# EAGLE design Proto-BoosterPack-RevA1 (EAGLE 6.3)
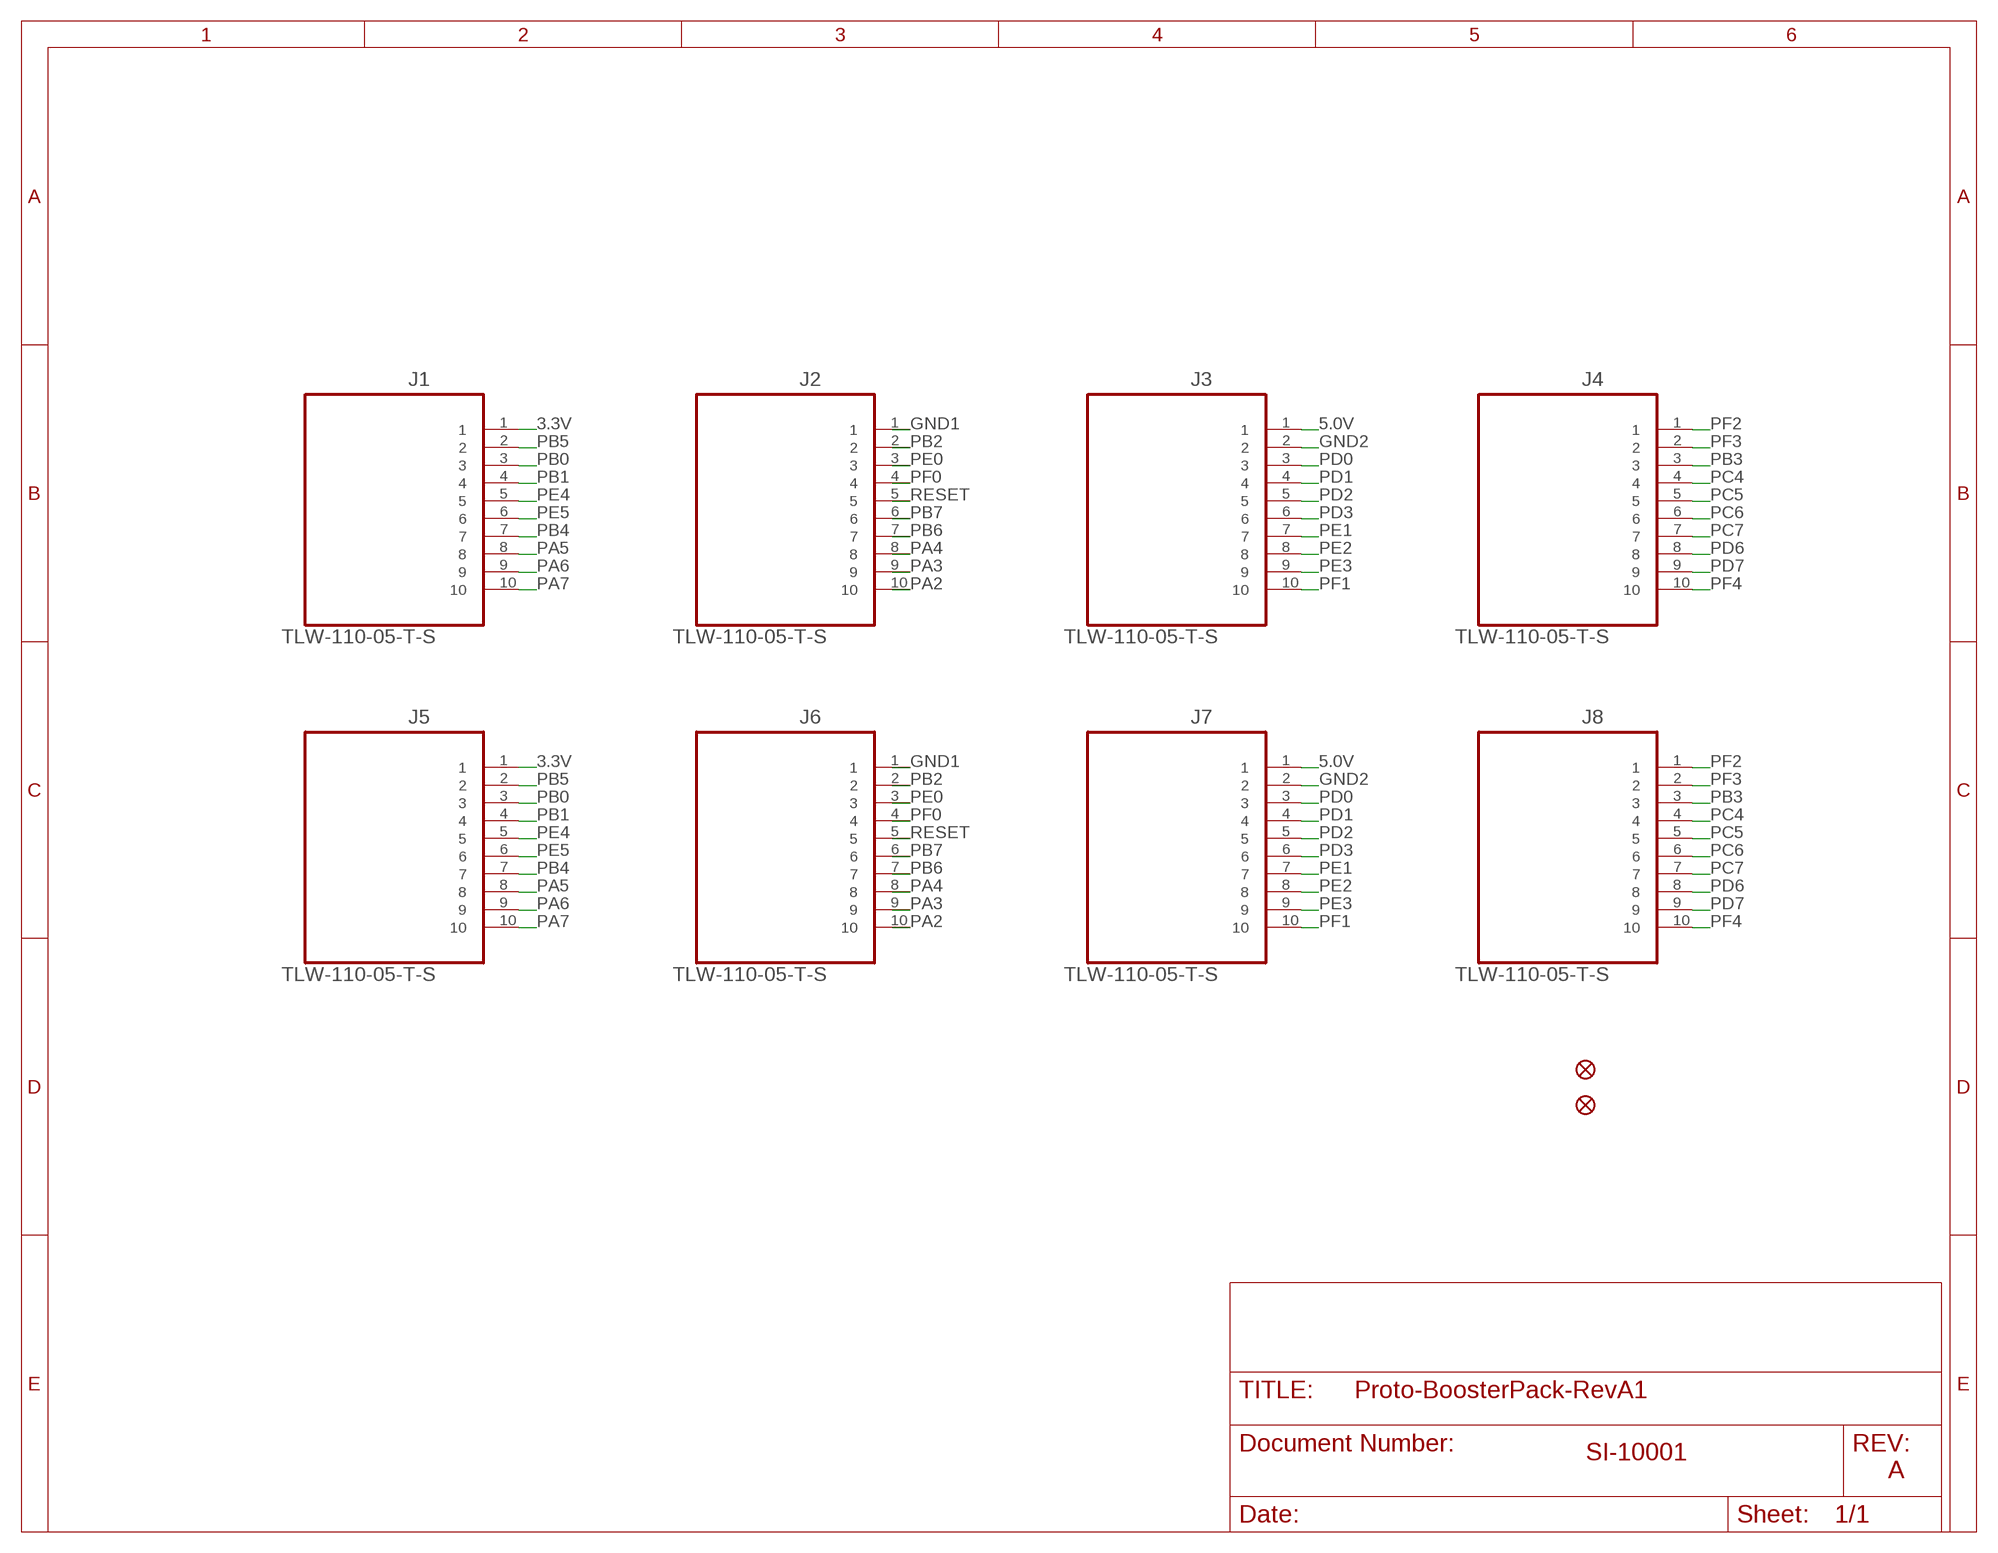
[diagram p0: schematic, sheet 1]

## Parts
FID1  FIDUCIAL1X2  [FIDUCIAL-1X2]
FID2  FIDUCIAL1X2  [FIDUCIAL-1X2]
J1  TLW-110-05-T-S  [SAMTEC_TLW-110-05-T-S]
J2  TLW-110-05-T-S  [SAMTEC_TLW-110-05-T-S]
J3  TLW-110-05-T-S  [SAMTEC_TLW-110-05-T-S]
J4  TLW-110-05-T-S  [SAMTEC_TLW-110-05-T-S]
J5  TLW-110-05-T-S  [SAMTEC_TLW-110-05-T-S]
J6  TLW-110-05-T-S  [SAMTEC_TLW-110-05-T-S]
J7  TLW-110-05-T-S  [SAMTEC_TLW-110-05-T-S]
J8  TLW-110-05-T-S  [SAMTEC_TLW-110-05-T-S]

## Nets
3.3V [power]: J1.1 J5.1
5.0V [power]: J3.1 J7.1
GND1 [power]: J2.1 J6.1
GND2 [power]: J3.2 J7.2
PA2: J2.10 J6.10
PA3: J2.9 J6.9
PA4: J2.8 J6.8
PA5: J1.8 J5.8
PA6: J1.9 J5.9
PA7: J1.10 J5.10
PB0: J1.3 J5.3
PB1: J1.4 J5.4
PB2: J2.2 J6.2
PB3: J4.3 J8.3
PB4: J1.7 J5.7
PB5: J1.2 J5.2
PB6: J2.7 J6.7
PB7: J2.6 J6.6
PC4: J4.4 J8.4
PC5: J4.5 J8.5
PC6: J4.6 J8.6
PC7: J4.7 J8.7
PD0: J3.3 J7.3
PD1: J3.4 J7.4
PD2: J3.5 J7.5
PD3: J3.6 J7.6
PD6: J4.8 J8.8
PD7: J4.9 J8.9
PE0: J2.3 J6.3
PE1: J3.7 J7.7
PE2: J3.8 J7.8
PE3: J3.9 J7.9
PE4: J1.5 J5.5
PE5: J1.6 J5.6
PF0: J2.4 J6.4
PF1: J3.10 J7.10
PF2: J4.1 J8.1
PF3: J4.2 J8.2
PF4: J4.10 J8.10
RESET: J2.5 J6.5

## Notes on the sheet
- SI-10001
- A

## Library data of the parts
FID1 FID2 = SparkFun-Aesthetics:FIDUCIAL: Fiducial Alignment Points Various fiducial points for machine vision alignment.
J1-J8 = SAMTEC-Txx_By_element14_Batch_1:TLW-110-05-T-S: CONNECTOR HEADER, 10 WAY, 1ROW; MPN: TLW-110-05-T-S; OC_FARNELL: -; OC_NEWARK: 12P0439; PACKAGE: CONN HEADER 10 POS .100 inch; SUPPLIER: SAMTEC

## Net classes
1 power: width 0.305 mm

## Board
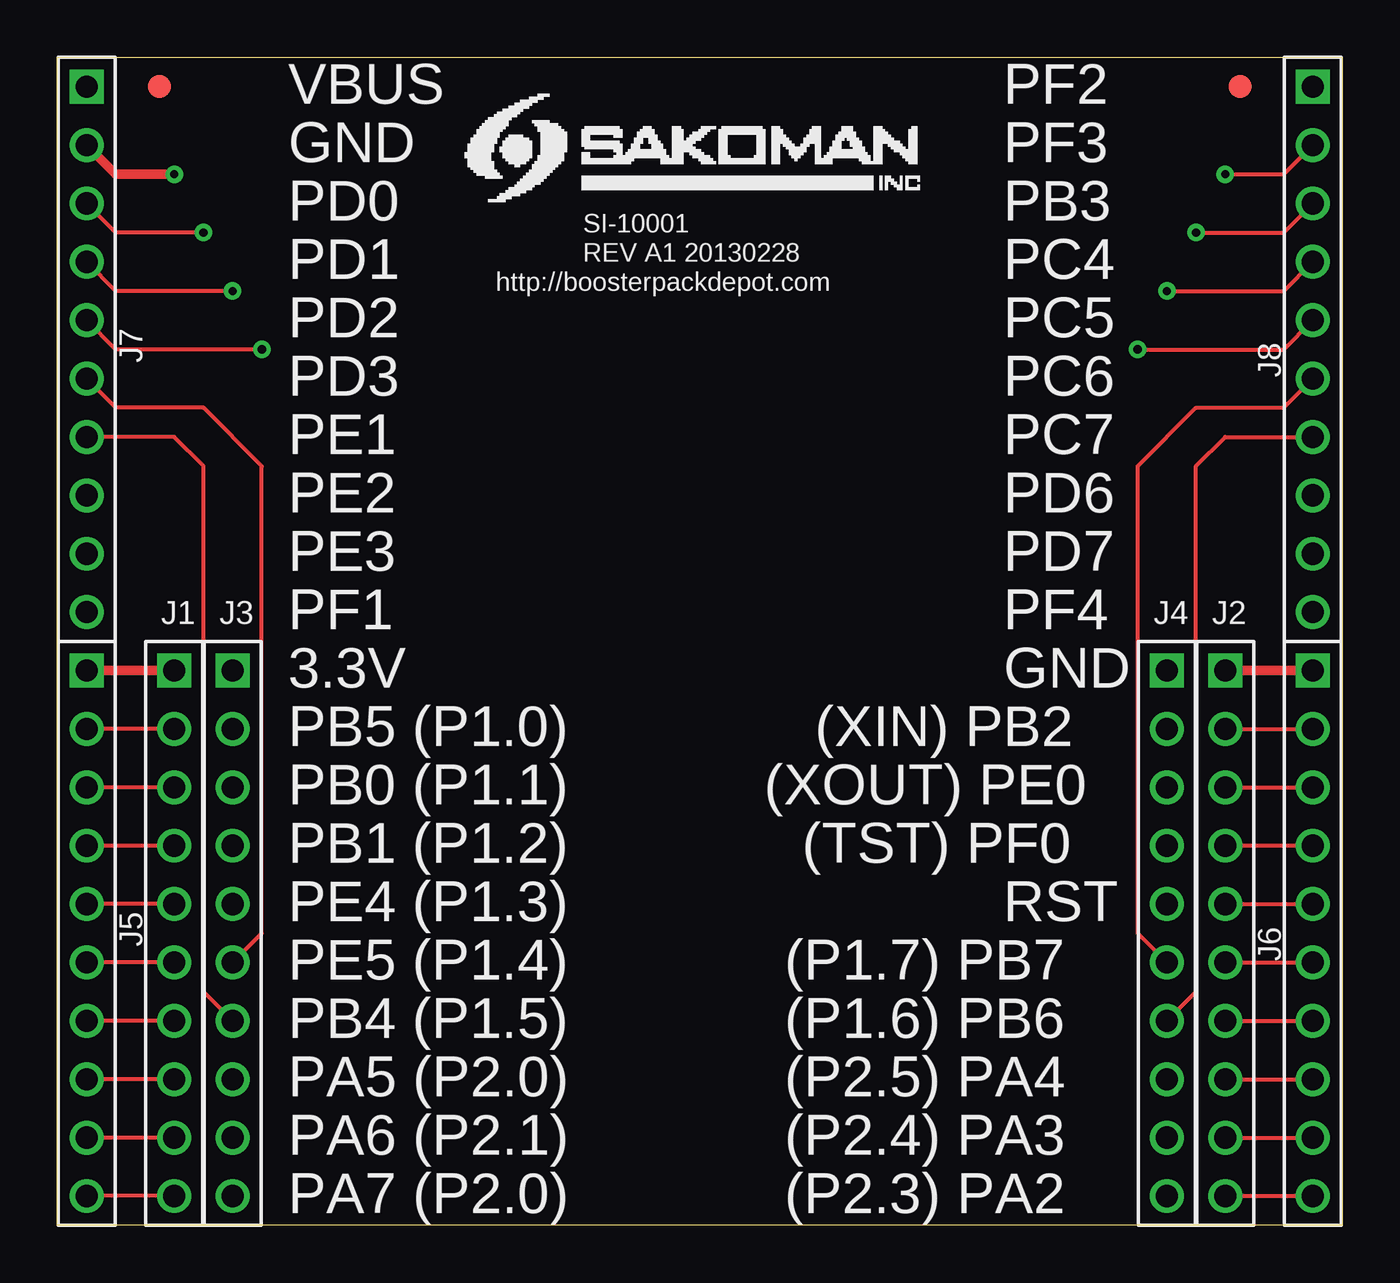
[diagram p1: board, top side]
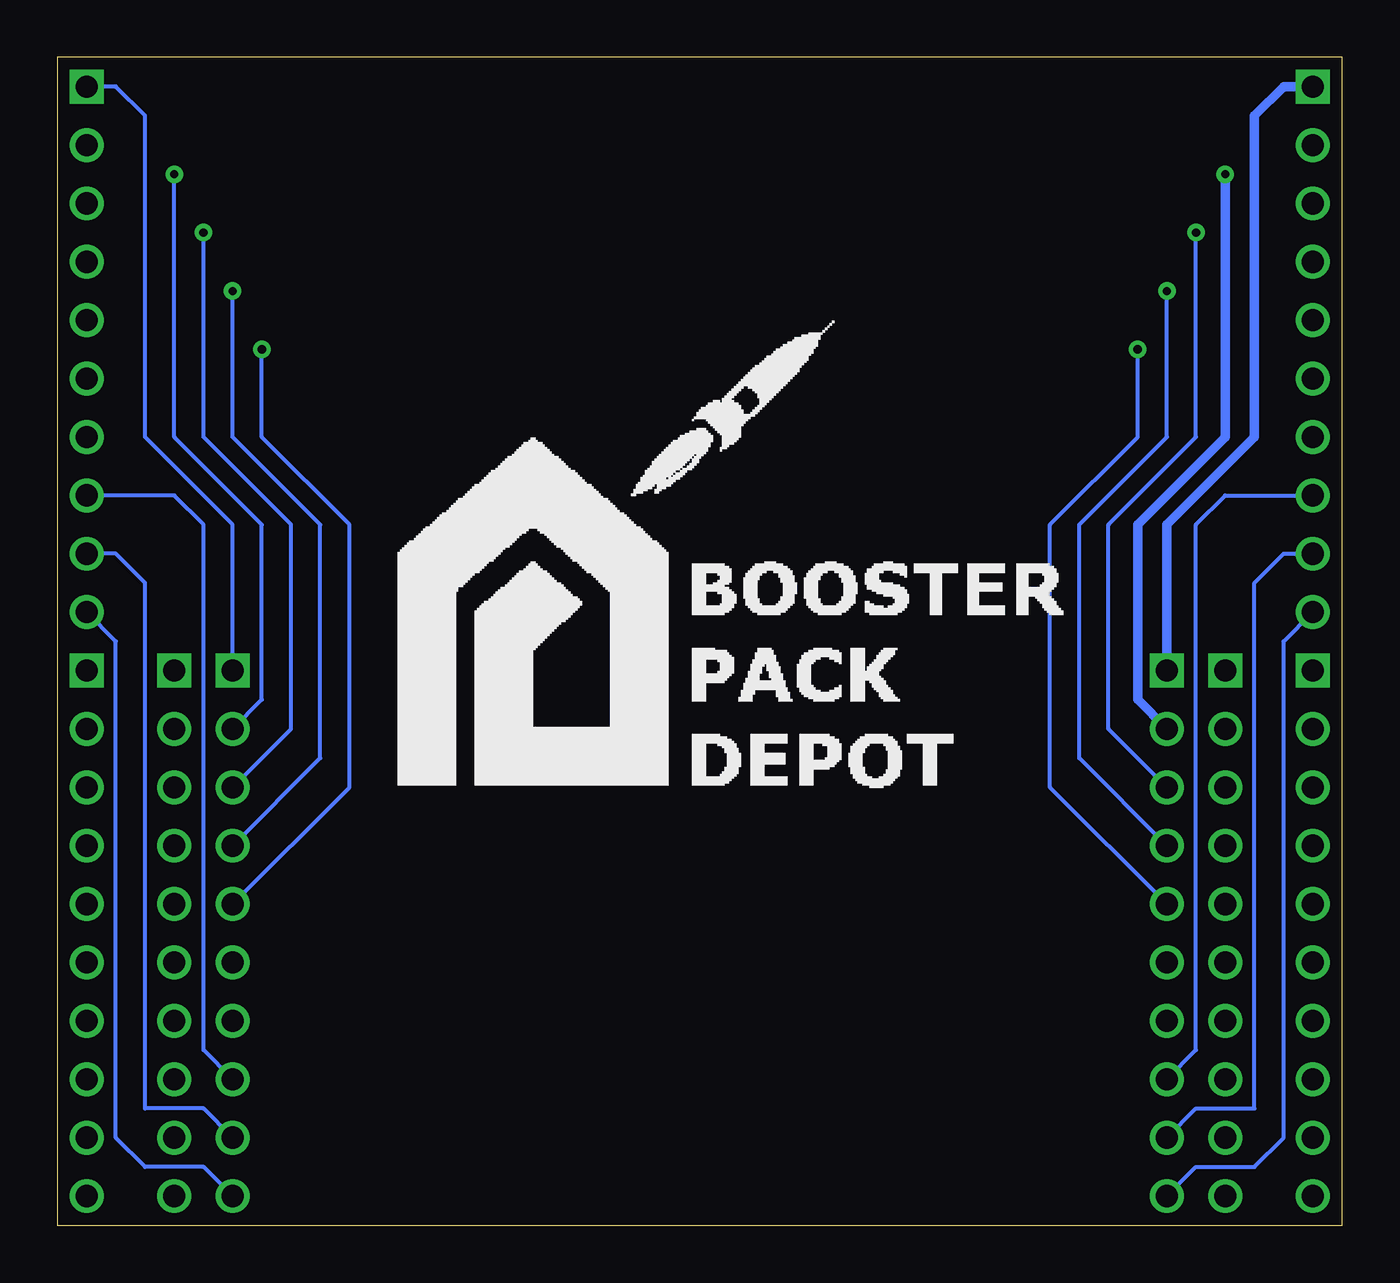
[diagram p2: board, bottom side, seen from below]

Size 55.88 x 50.8 mm. Coordinates in mm from the lower left corner, seen from the top.
Outline: 0,0 0,50.8 55.88,50.8 55.88,0 0,0
Copper layers (1*16): Top 0.0356mm / dielectric 1.5011mm / Bottom 0.0356mm
Design rules "SilverCircuits": minimum track width 7mil, minimum drill 14mil, track to track 7mil, track to pad 7mil, pad to pad 7mil, via to via 7mil, smd to smd 0mil, copper to edge 20mil, drill to drill 8mil, minimum pad ring 10mil, minimum via ring 8mil, stop-mask expansion 4mil, vias tented up to drill 0mil, thermal gap 10mil

### Footprints (pad centres in the part's own frame; a part is rotated, then mirrored left to right if it is on the bottom)
FIDUCIAL-1X2 = smd 1 x 1: 1 0,0
SAMTEC_TLW-110-05-T-S = drill 0.965 square: 1 -22.86,0 | drill 0.965: 2 -20.32,0; 3 -17.78,0; 4 -15.24,0; 5 -12.7,0; 6 -10.16,0; 7 -7.62,0; 8 -5.08,0; 9 -2.54,0; 10 0,0

### Placement (x,y rotation side)
FID1  4.45,49.53 0 top
FID2  51.44,49.53 0 top
J1  5.08,1.27 270 top
J2  50.8,1.27 270 top
J3  7.62,1.27 270 top
J4  48.26,1.27 270 top
J5  1.27,1.27 270 top
J6  54.61,1.27 270 top
J7  1.27,26.67 270 top
J8  54.61,26.67 270 top

### Tracks (layer width: path | path; a pad name or v marks a point on that pad's centre or on a via)
3.3V
  Top 0.406: J1.1 J5.1
5.0V
  Bottom 0.406: J3.1 7.62,30.48 3.81,34.29 3.81,48.26 2.54,49.53 J7.1
GND1
  Top 0.406: J2.1 J6.1
GND2  (via drill 0.36)
  Top 0.406: J7.2 2.54,45.72 v5.08,45.72
  Bottom 0.406: J3.2 8.89,22.86 8.89,30.48 5.08,34.29 v5.08,45.72
PA2
  Top 0.178: J2.10 J6.10
PA3
  Top 0.178: J2.9 J6.9
PA4
  Top 0.178: J2.8 J6.8
PA5
  Top 0.178: J1.8 J5.8
PA6
  Top 0.178: J1.9 J5.9
PA7
  Top 0.178: J1.10 J5.10
PB0
  Top 0.178: J1.3 J5.3
PB1
  Top 0.178: J1.4 J5.4
PB2
  Top 0.178: J2.2 J6.2
PB3  (via drill 0.36)
  Top 0.178: J8.3 53.34,43.18 v49.53,43.18
  Bottom 0.178: J4.3 45.72,21.59 45.72,30.48 49.53,34.29 v49.53,43.18
PB4
  Top 0.178: J1.7 J5.7
PB5
  Top 0.178: J1.2 J5.2
PB6
  Top 0.178: J2.7 J6.7
PB7
  Top 0.178: J2.6 J6.6
PC4  (via drill 0.36)
  Top 0.178: J8.4 53.34,40.64 v48.26,40.64
  Bottom 0.178: J4.4 44.45,20.32 44.45,30.48 48.26,34.29 v48.26,40.64
PC5  (via drill 0.36)
  Top 0.178: J8.5 53.34,38.1 v46.99,38.1
  Bottom 0.178: J4.5 43.18,19.05 43.18,30.48 46.99,34.29 v46.99,38.1
PC6
  Top 0.178: J4.6 46.99,12.7 46.99,33.02 49.53,35.56 53.34,35.56 J8.6
PC7
  Top 0.178: J4.7 49.53,10.16 49.53,33.02 50.8,34.29 J8.7
PD0  (via drill 0.36)
  Top 0.178: J7.3 2.54,43.18 v6.35,43.18
  Bottom 0.178: J3.3 10.16,21.59 10.16,30.48 6.35,34.29 v6.35,43.18
PD1  (via drill 0.36)
  Top 0.178: J7.4 2.54,40.64 v7.62,40.64
  Bottom 0.178: J3.4 11.43,20.32 11.43,30.48 7.62,34.29 v7.62,40.64
PD2  (via drill 0.36)
  Top 0.178: J7.5 2.54,38.1 v8.89,38.1
  Bottom 0.178: J3.5 12.7,19.05 12.7,30.48 8.89,34.29 v8.89,38.1
PD3
  Top 0.178: J3.6 8.89,12.7 8.89,33.02 6.35,35.56 2.54,35.56 J7.6
PD6
  Bottom 0.178: J4.8 49.53,7.62 49.53,30.48 50.8,31.75 J8.8
PD7
  Bottom 0.178: J4.9 49.53,5.08 52.07,5.08 52.07,27.94 53.34,29.21 J8.9
PE0
  Top 0.178: J2.3 J6.3
PE1
  Top 0.178: J3.7 6.35,10.16 6.35,33.02 5.08,34.29 J7.7
PE2
  Bottom 0.178: J3.8 6.35,7.62 6.35,30.48 5.08,31.75 J7.8
PE3
  Bottom 0.178: J3.9 6.35,5.08 3.81,5.08 3.81,27.94 2.54,29.21 J7.9
PE4
  Top 0.178: J1.5 J5.5
PE5
  Top 0.178: J1.6 J5.6
PF0
  Top 0.178: J6.4 J2.4
PF1
  Bottom 0.178: J3.10 6.35,2.54 3.81,2.54 2.54,3.81 2.54,25.4 J7.10
PF2
  Bottom 0.178: J4.1 48.26,30.48 52.07,34.29 52.07,48.26 53.34,49.53 J8.1
PF3  (via drill 0.36)
  Top 0.178: J8.2 53.34,45.72 v50.8,45.72
  Bottom 0.178: J4.2 46.99,22.86 46.99,30.48 50.8,34.29 v50.8,45.72
PF4
  Bottom 0.178: J4.10 49.53,2.54 52.07,2.54 53.34,3.81 53.34,25.4 J8.10
RESET
  Top 0.178: J2.5 J6.5

### Text on the board
tPlace: VBUS | PF2 | GND | PF3 | PD0 | PB3 | SI-10001 | REV A1 20130228 | PD1 | http://boosterpackdepot.com | PC4 | PD2 | PC5 | PD3 | PC6 | PE1 | PC7 | PE2 | PD6 | PE3 | PD7 | PF1 | PF4 | 3.3V | GND | PB5 (P1.0) | (XIN) PB2 | PB0 (P1.1) | (XOUT) PE0 | PB1 (P1.2) | (TST) PF0 | PE4 (P1.3) | RST | PE5 (P1.4) | (P1.7) PB7 | PB4 (P1.5) | (P1.6) PB6 | PA5 (P2.0) | (P2.5) PA4 | PA6 (P2.1) | (P2.4) PA3 | PA7 (P2.0) | (P2.3) PA2